# Altium schematic sheet PSU1.SchDoc: PCB-Tester PSU1
size A4; Date: JUN 2020; CheckedBy: Moerz, Hoeren; Author: Rudziński; CompanyName: TDK-Micronas GmbH; DrawnBy: Rudziński; Engineer: Rudziński; Organization: Test Engineering; Address1: Hans-Bunte-Strasse 19; Address2: D-79108 Freiburg; Address3: Germany; DocumentNumber: U33110; Revision: V1.0; SheetNumber: 13; SheetTotal: 18; DateDraw: JUN 2020; DateChecked: 2020-06-19; Workspace: Workspace; TitleTyp: Title-Typ; PageSetup: Record=PageOptions|CenterHorizontal=True|CenterVertical=True|PrintScale=0.97|XCorrection=1.00|YCorrection=1.00|PrintKind=0|BorderSize=5000000|LeftOffset=0|BottomOffset=0|Orientation=2|PaperLength=1000|PaperWidth=1000|Scale=100|PaperSource=7|PrintQuality=-3|MediaType=1|DitherType=10|PrintScaleMode=1|PaperKind=A4|PaperIndex=9
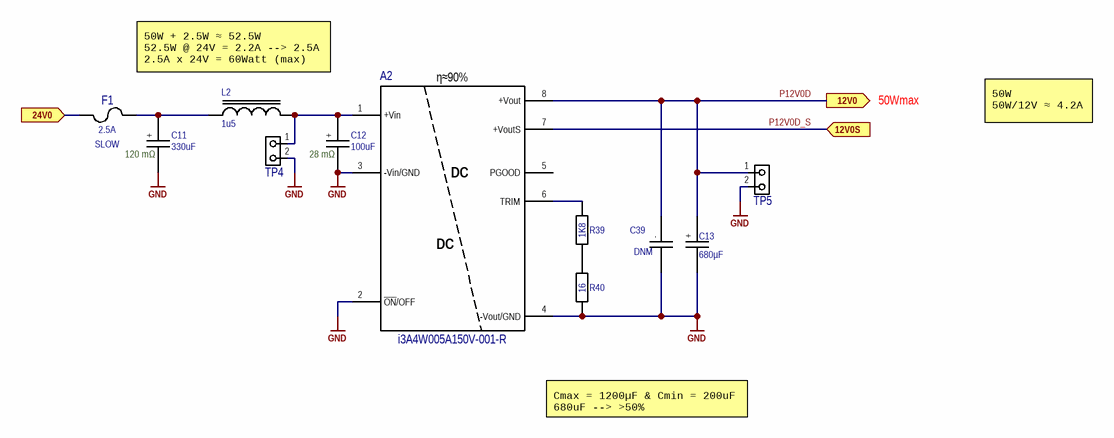
[diagram p0: PSU1.SchDoc]

## Parts
A2  Efficiency: η≈90%  [I3A-POSETIVE]  (hidden comment: A)
C11  value 330uF  ESR: 120 mΩ  [SMD-CAP-ALU-G]  (hidden comment: C+)
C12  value 100uF  ESR: 28 mΩ  [SMD-CAP-ALU-G]  (hidden comment: C+)
C13  value 680µF  [CAP_EL_KE0]  (hidden comment: C+)
C39  value DNM  [C0402 Reflow]  (hidden comment: C)  (no BOM)
F1  value 2.5A  Speed: SLOW  [OMNI-Fuse]  (hidden comment: F)
L2  Inductance: 1u5  [XAL4020]  (hidden comment: L)
R39  value 1K8  [R0603 Reflow]  (hidden comment: R)
R40  value 16  [R0603 Reflow]  (hidden comment: R)
TP4  TP  [DualTestpoint 100mils]  (value not drawn)  (no BOM)
TP5  TP  [DualTestpoint 100mils]  (value not drawn)  (no BOM)

## Ports
12V0 (out), 12V0S (in), 24V0 (in)

## Nets
GND: A2.2(~{ON}/OFF) A2.3(-Vin/GND) A2.4(-Vout/GND) C11.2 C12.2 C13.2 C39.2 R40.1 TP4.2 TP5.2
24V0: F1.1 ; port 24V0
P12V0D: A2.8(+Vout) C13.1 C39.1 TP5.1 ; port 12V0
P12V0D_S: A2.7(+VoutS) ; port 12V0S
NetA2_1: A2.1(+Vin) C12.1 L2.1 TP4.1
NetA2_6: A2.6(TRIM) R39.2
NetC11_1: C11.1 F1.2 L2.2
NetR39_1: R39.1 R40.2

Not connected (* = marked no-connect by the designer): A2 5(PGOOD)

## Notes on the sheet
- 50W + 2.5W ≈ 52.5W
  52.5W @ 24V = 2.2A --> 2.5A
  2.5A x 24V = 60Watt (max)
- 50Wmax
- 50W
  50W/12V ≈ 4.2A
- Cmax = 1200µF & Cmin = 200uF
  680uF --> >50%
- designed by
- reviewed by
- last drawn by
- Project:
- Schematic:
- last printed
- DIN-A4 L
- sheets
- of
- File:
- (in symbol C) .
- (in symbol C+) +
- (in symbol i3A4W005A150V-001-R) DC

## Library data of the parts
A2 = i3A4W005A150V-001-R: DC DC CONVERTER 5-30V 135W; 04. Manufacturer: TDK-Lambda Americas Inc.; 03. Unit Price: 20.18; 13. Created Date/Name: AUG 2018 / Hören; 01. Distributor: Digi-Key; 02. Distributor Part Number: 285-2719-ND; 07. Manufacturer  Part Number: I3A4W005A150V-001-R; ComponentLink1Description: Info; ComponentLink1URL: https://www.digikey.de/products/en/power-supplies-board-mount/dc-dc-converters/922?k=i3A4W005A150V; ComponentLink2Description: DataSheet; ComponentLink2URL: https://www.us.tdk-lambda.com/ftp/specs/i3a_full_datasheet.pdf?ref_disty=digikey; NicName: i3A4W005A150V-001-R
C11 = C+: CAP ALUM 330UF 20% 50V SMD; 04. Manufacturer: Panasonic Electronic Components; 07. Manufacturer  Part Number: EEE-FT1H331AP; 03. Unit Price: 0.96; 13. Created Date/Name: AUG2018/Hören; 3D-Export: No; ComponentLink1Description: Info; ComponentLink1URL: https://www.digikey.de/product-detail/en/panasonic-electronic-components/EEE-FT1H331AP/PCE5026DKR-ND/2652105; Tolerance: ±20%; Voltage Rating: 50V; 02. Distributor Part Number: PCE5026DKR-ND; 09. Operating Temperature: -55°C ~ 105°C; 11. RoHS: YES; 01. Distributor: DigiKey; ComponentLink2Description: DataSheet; ComponentLink2URL: https://industrial.panasonic.com/cdbs/www-data/pdf/RDE0000/ABA0000C1240.pdf
C12 = C+: CAP ALUM POLY HYB 100UF 50V SMD; 04. Manufacturer: Panasonic Electronic Components; 07. Manufacturer  Part Number: EEH-ZA1H101P; Tolerance: ±20%; 03. Unit Price: 2.5; 13. Created Date/Name: AUG2018/Hören; 3D-Export: No; ComponentLink1Description: Info; ComponentLink1URL: https://www.digikey.de/product-detail/en/panasonic-electronic-components/EEH-ZA1H101P/P15442DKR-ND/3088152; Voltage Rating: 50V; 02. Distributor Part Number: P15442DKR-ND; 09. Operating Temperature: -55°C ~ 105°C; 11. RoHS: YES; 01. Distributor: DigiKey; ComponentLink2Description: DataSheet; ComponentLink2URL: https://industrial.panasonic.com/cdbs/www-data/pdf/RDD0000/ABA0000C1221.pdf
C13 = C+: CAP ALUM 680UF 20% 50V SMD; 04. Manufacturer: Panasonic Electronic Components; 07. Manufacturer  Part Number: EEV-FK1V681Q; ESR: 60 mΩ; Voltage Rating: 35V; Type: Radial, Can - SMD; 03. Unit Price: 1.25; Lifetime @ Temp: 5000 Hrs @ 105°C; 3D-Export: No; ComponentLink1Description: Info; ComponentLink1URL: https://www.digikey.de/product-detail/en/panasonic-electronic-components/EEV-FK1H681M/PCE3523DKR-ND/1838505; Tolerance: ±20%; 02. Distributor Part Number: PCE3465CT-ND; 09. Operating Temperature: -55°C ~ 105°C; 11. RoHS: YES; 01. Distributor: DigiKey; ComponentLink2Description: DataSheet; ComponentLink2URL: https://industrial.panasonic.com/cdbs/www-data/pdf/RDE0000/ABA0000C1181.pdf; Package: Ø12.5 mm x 13.5mm
C39 = C: CAP CER 0.1UF 16V X7R 0402; 04. Manufacturer: KEMET; 07. Manufacturer  Part Number: C0402C104J4RACTU; Tolerance: ±5%; 03. Unit Price: 0.45; 13. Created Date/Name: AUG2018/Hören; Voltage Rating: 16V; Type: X7R; ComponentLink1Description: Info; ComponentLink1URL: https://www.digikey.de/product-detail/en/kemet/C0402C104J4RACTU/399-7761-6-ND/3472292; 02. Distributor Part Number: 399-7761-6-ND; 09. Operating Temperature: -55°C ~ 125°C; 11. RoHS: YES; 01. Distributor: DigiKey; ComponentLink2Description: DataSheet; ComponentLink2URL: https://content.kemet.com/datasheets/KEM_C1002_X7R_SMD.pdf; Package: 0402
F1 = Fuse: FUSE BRD MNT 2.5A 125VAC/VDC SMD; 04. Manufacturer: Littelfuse Inc.; 07. Manufacturer  Part Number: 015402.5DRT; 03. Unit Price: 2.75; 13. Created Date/Name: AUG 2018 / Hören; 3D-Export: No; 01. Distributor: DigiKey; 02. Distributor Part Number: F1306DKR-ND; 09. Operating Temperature: -55°C ~ 125°C; 11. RoHS: YES; ComponentLink1Description: Info; ComponentLink1URL: https://www.digikey.de/products/en/circuit-protection/fuses/139?k=&pkeyword=&sv=0&pv7=243&sf=0&FV=ffec3b86%2Cffec4f0c%2Cffec8a72%2Cffec8a73%2Cfffc0012%2C55c00d7%2C1f140000%2Cffe0008b%2Cmu2.5A%7C2088&quantity=&ColumnSort=0&page=1&pageSize=25; ComponentLink2Description: DataSheet; ComponentLink2URL: https://www.littelfuse.com/~/media/electronics/datasheets/fuses/littelfuse_fuse_154_154t_154l_154tl_datasheet.pdf.pdf
L2 = INDUCTOR: Fixed Inductors 1.5uH Shld 20% 7.5A 23.6mOhms AECQ2; 04. Manufacturer: Coilcraft; 07. Manufacturer  Part Number: XAL4020-152MEC; Impedance Tolerance: %; 03. Unit Price: 1.75; ComponentLink1Description: Info; ComponentLink1URL: https://www.digikey.de/products/en?keywords=732-1620-6-ND; ComponentLink2Description: DataSheet; ComponentLink2URL: https://www.we-online.de/katalog/datasheet/742792040.pdf; 02. Distributor Part Number: 994-XAL4020-152MEC; 11. RoHS: YES; Tolerance: *; Value: *; 01. Distributor: Mouser
R39 = R: RES SMD 1.8K OHM 1% 1/16W 0402; 04. Manufacturer: Yageo; 07. Manufacturer  Part Number: RC0402FR-071K8L; 03. Unit Price: 0.09; 13. Created Date/Name: AUG2018/Hören; Power Rating: 200mW; 3D-Export: No; Tolerance: ±1%; ComponentLink1URL: https://www.digikey.de/product-detail/en/panasonic-electronic-components/ERJ-PB3B1801V/P19999DKR-ND/6215726; ComponentLink1Description: Info; 02. Distributor Part Number: 311-1.80KLRCT-ND; 09. Operating Temperature: -55°C ~ 155°C; 11. RoHS: YES; 01. Distributor: DigiKey; ComponentLink2Description: DataSheet; ComponentLink2URL: https://industrial.panasonic.com/cdbs/www-data/pdf/RDM0000/AOA0000C328.pdf; Package: 0603
R40 = R: RES SMD 16 OHM 1% 1/10W 0603; 04. Manufacturer: Yageo; 07. Manufacturer  Part Number: RC0603FR-0716RL; 03. Unit Price: 0.09; 13. Created Date/Name: AUG2018/Hören; Power Rating: 100mW; 3D-Export: No; Tolerance: ±1%; ComponentLink1URL: https://www.digikey.de/product-detail/en/yageo/RC0603FR-0716R2L/311-16.2HRDKR-ND/732860; ComponentLink1Description: Info; 02. Distributor Part Number: 311-16.0HRDKR-ND; 09. Operating Temperature: -55°C ~ 155°C; 11. RoHS: YES; 01. Distributor: DigiKey; ComponentLink2Description: DataSheet; ComponentLink2URL: http://www.yageo.com/documents/recent/PYu-RC_Group_51_RoHS_L_10.pdf; Type: Thick Film; Package: 0603
TP4 TP5 = DualTestpoint 100mils: Dual testpoint, pitch 2.54mm; 04. Manufacturer: Samtec Inc.; 07. Manufacturer  Part Number: HMTSW-103-07-G-S-240; 03. Unit Price: 0.25; 13. Created Date/Name: AUG2018/Hören; 01. Distributor: Samtec Inc.; 02. Distributor Part Number: HMTSW-103-07-G-S-240; 11. RoHS: YES; ComponentLink1Description: Info; ComponentLink1URL: https://www.samtec.com/products/hmtsw-103-07-g-s-240; ComponentLink2Description: DataSheet; ComponentLink2URL: http://suddendocs.samtec.com/catalog_english/hmtsw.pdf